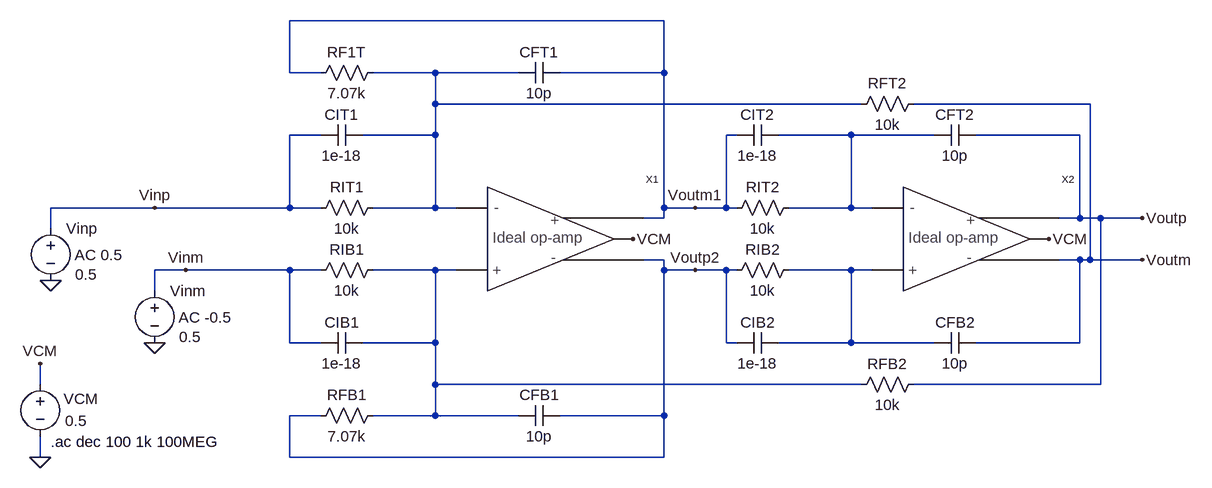
[diagram p0: schematic _Fig3_38_MSD.asc]
_Fig3_38_MSD.asc, the LTspice schematic file:
Version 4
SHEET 1 2748 704
WIRE 1472 -736 896 -736
WIRE 896 -656 896 -736
WIRE 944 -656 896 -656
WIRE 1120 -656 1024 -656
WIRE 1248 -656 1120 -656
WIRE 1472 -656 1472 -736
WIRE 1472 -656 1312 -656
WIRE 1120 -608 1120 -656
WIRE 1776 -608 1120 -608
WIRE 2128 -608 1856 -608
WIRE 944 -560 896 -560
WIRE 1120 -560 1120 -608
WIRE 1120 -560 1008 -560
WIRE 1584 -560 1568 -560
WIRE 1760 -560 1648 -560
WIRE 1888 -560 1760 -560
WIRE 2112 -560 1952 -560
WIRE 688 -448 528 -448
WIRE 896 -448 896 -560
WIRE 896 -448 688 -448
WIRE 944 -448 896 -448
WIRE 1120 -448 1120 -560
WIRE 1120 -448 1024 -448
WIRE 1152 -448 1120 -448
WIRE 1472 -448 1472 -656
WIRE 1520 -448 1472 -448
WIRE 1568 -448 1568 -560
WIRE 1568 -448 1520 -448
WIRE 1584 -448 1568 -448
WIRE 1760 -448 1760 -560
WIRE 1760 -448 1664 -448
WIRE 1792 -448 1760 -448
WIRE 1472 -432 1472 -448
WIRE 1472 -432 1440 -432
WIRE 2112 -432 2112 -560
WIRE 2112 -432 2080 -432
WIRE 2144 -432 2112 -432
WIRE 2208 -432 2144 -432
WIRE 528 -416 528 -448
WIRE 1472 -368 1440 -368
WIRE 2112 -368 2080 -368
WIRE 2128 -368 2128 -608
WIRE 2128 -368 2112 -368
WIRE 2208 -368 2128 -368
WIRE 736 -352 688 -352
WIRE 896 -352 736 -352
WIRE 944 -352 896 -352
WIRE 1120 -352 1024 -352
WIRE 1152 -352 1120 -352
WIRE 1472 -352 1472 -368
WIRE 1520 -352 1472 -352
WIRE 1568 -352 1520 -352
WIRE 1584 -352 1568 -352
WIRE 1760 -352 1664 -352
WIRE 1792 -352 1760 -352
WIRE 688 -320 688 -352
WIRE 896 -240 896 -352
WIRE 944 -240 896 -240
WIRE 1120 -240 1120 -352
WIRE 1120 -240 1008 -240
WIRE 1568 -240 1568 -352
WIRE 1584 -240 1568 -240
WIRE 1760 -240 1760 -352
WIRE 1760 -240 1648 -240
WIRE 1888 -240 1760 -240
WIRE 2112 -240 2112 -368
WIRE 2112 -240 1952 -240
WIRE 512 -176 512 -208
WIRE 1120 -176 1120 -240
WIRE 1776 -176 1120 -176
WIRE 2144 -176 2144 -432
WIRE 2144 -176 1856 -176
WIRE 944 -128 896 -128
WIRE 1120 -128 1120 -176
WIRE 1120 -128 1024 -128
WIRE 1248 -128 1120 -128
WIRE 1472 -128 1472 -352
WIRE 1472 -128 1312 -128
WIRE 512 -64 512 -96
WIRE 896 -64 896 -128
WIRE 1472 -64 1472 -128
WIRE 1472 -64 896 -64
FLAG 512 -64 0
FLAG 512 -208 VCM
FLAG 1424 -400 VCM
FLAG 1520 -448 Voutm1
FLAG 1520 -352 Voutp2
FLAG 528 -336 0
FLAG 688 -448 Vinp
FLAG 736 -352 Vinm
FLAG 688 -240 0
FLAG 2064 -400 VCM
FLAG 2208 -432 Voutp
FLAG 2208 -368 Voutm
SYMBOL Ideal_differential_op_amp 1200 -400 R0
SYMATTR InstName X1
SYMBOL voltage 512 -192 R0
WINDOW 0 36 38 Left 0
WINDOW 3 38 72 Left 0
SYMATTR InstName VCM
SYMATTR Value 0.5
SYMBOL cap 1312 -672 R90
WINDOW 0 0 32 VBottom 0
WINDOW 3 32 32 VTop 0
SYMATTR InstName CFT1
SYMATTR Value 10p
SYMBOL cap 1312 -144 R90
WINDOW 0 0 32 VBottom 0
WINDOW 3 32 32 VTop 0
SYMATTR InstName CFB1
SYMATTR Value 10p
SYMBOL res 1040 -672 R90
WINDOW 0 0 56 VBottom 0
WINDOW 3 32 56 VTop 0
SYMATTR InstName RF1T
SYMATTR Value 7.07k
SYMBOL res 1040 -464 R90
WINDOW 0 0 56 VBottom 0
WINDOW 3 32 56 VTop 0
SYMATTR InstName RIT1
SYMATTR Value 10k
SYMBOL res 1040 -368 R90
WINDOW 0 0 56 VBottom 0
WINDOW 3 32 56 VTop 0
SYMATTR InstName RIB1
SYMATTR Value 10k
SYMBOL res 1040 -144 R90
WINDOW 0 0 56 VBottom 0
WINDOW 3 32 56 VTop 0
SYMATTR InstName RFB1
SYMATTR Value 7.07k
SYMBOL voltage 528 -432 R0
WINDOW 3 38 87 Left 0
WINDOW 123 37 57 Left 0
WINDOW 39 0 0 Left 0
SYMATTR Value 0.5
SYMATTR Value2 AC 0.5
SYMATTR InstName Vinp
SYMBOL voltage 688 -336 R0
WINDOW 3 38 87 Left 0
WINDOW 123 37 57 Left 0
WINDOW 39 0 0 Left 0
SYMATTR Value 0.5
SYMATTR Value2 AC -0.5
SYMATTR InstName Vinm
SYMBOL cap 1008 -576 R90
WINDOW 0 0 32 VBottom 0
WINDOW 3 32 32 VTop 0
SYMATTR InstName CIT1
SYMATTR Value 1e-18
SYMBOL cap 1008 -256 R90
WINDOW 0 0 32 VBottom 0
WINDOW 3 32 32 VTop 0
SYMATTR InstName CIB1
SYMATTR Value 1e-18
SYMBOL Ideal_differential_op_amp 1840 -400 R0
SYMATTR InstName X2
SYMBOL cap 1952 -576 R90
WINDOW 0 0 32 VBottom 0
WINDOW 3 32 32 VTop 0
SYMATTR InstName CFT2
SYMATTR Value 10p
SYMBOL cap 1952 -256 R90
WINDOW 0 0 32 VBottom 0
WINDOW 3 32 32 VTop 0
SYMATTR InstName CFB2
SYMATTR Value 10p
SYMBOL res 1872 -624 R90
WINDOW 0 0 56 VBottom 0
WINDOW 3 32 56 VTop 0
SYMATTR InstName RFT2
SYMATTR Value 10k
SYMBOL res 1680 -464 R90
WINDOW 0 0 56 VBottom 0
WINDOW 3 32 56 VTop 0
SYMATTR InstName RIT2
SYMATTR Value 10k
SYMBOL res 1680 -368 R90
WINDOW 0 0 56 VBottom 0
WINDOW 3 32 56 VTop 0
SYMATTR InstName RIB2
SYMATTR Value 10k
SYMBOL res 1872 -192 R90
WINDOW 0 0 56 VBottom 0
WINDOW 3 32 56 VTop 0
SYMATTR InstName RFB2
SYMATTR Value 10k
SYMBOL cap 1648 -576 R90
WINDOW 0 0 32 VBottom 0
WINDOW 3 32 32 VTop 0
SYMATTR InstName CIT2
SYMATTR Value 1e-18
SYMBOL cap 1648 -256 R90
WINDOW 0 0 32 VBottom 0
WINDOW 3 32 32 VTop 0
SYMATTR InstName CIB2
SYMATTR Value 1e-18
TEXT 528 -88 Left 0 !.ac dec 100 1k 100MEG

The netlist it stands for:
* _Fig3_38_MSD.asc
XX1 N001 N003 Voutm1 VCM Voutp2 Ideal_differential_op_amp  ; pins Vinm Vinp Outp VCM Outm
VCM VCM 0 0.5
CFT1 Voutm1 N001 10p
CFB1 Voutp2 N003 10p
RF1T N001 Voutm1 7.07k
RIT1 N001 Vinp 10k
RIB1 N003 Vinm 10k
RFB1 N003 Voutp2 7.07k
Vinp Vinp 0 0.5 AC 0.5
Vinm Vinm 0 0.5 AC -0.5
CIT1 N001 Vinp 1e-18
CIB1 N003 Vinm 1e-18
XX2 N002 N004 Voutp VCM Voutm Ideal_differential_op_amp  ; pins Vinm Vinp Outp VCM Outm
CFT2 Voutp N002 10p
CFB2 Voutm N004 10p
RFT2 Voutm N001 10k
RIT2 N002 Voutm1 10k
RIB2 N004 Voutp2 10k
RFB2 Voutp N003 10k
CIT2 N002 Voutm1 1e-18
CIB2 N004 Voutp2 1e-18
.ac dec 100 1k 100MEG
.backanno
.end